# EAGLE design Hi-Hat copy (EAGLE 9.2.2)
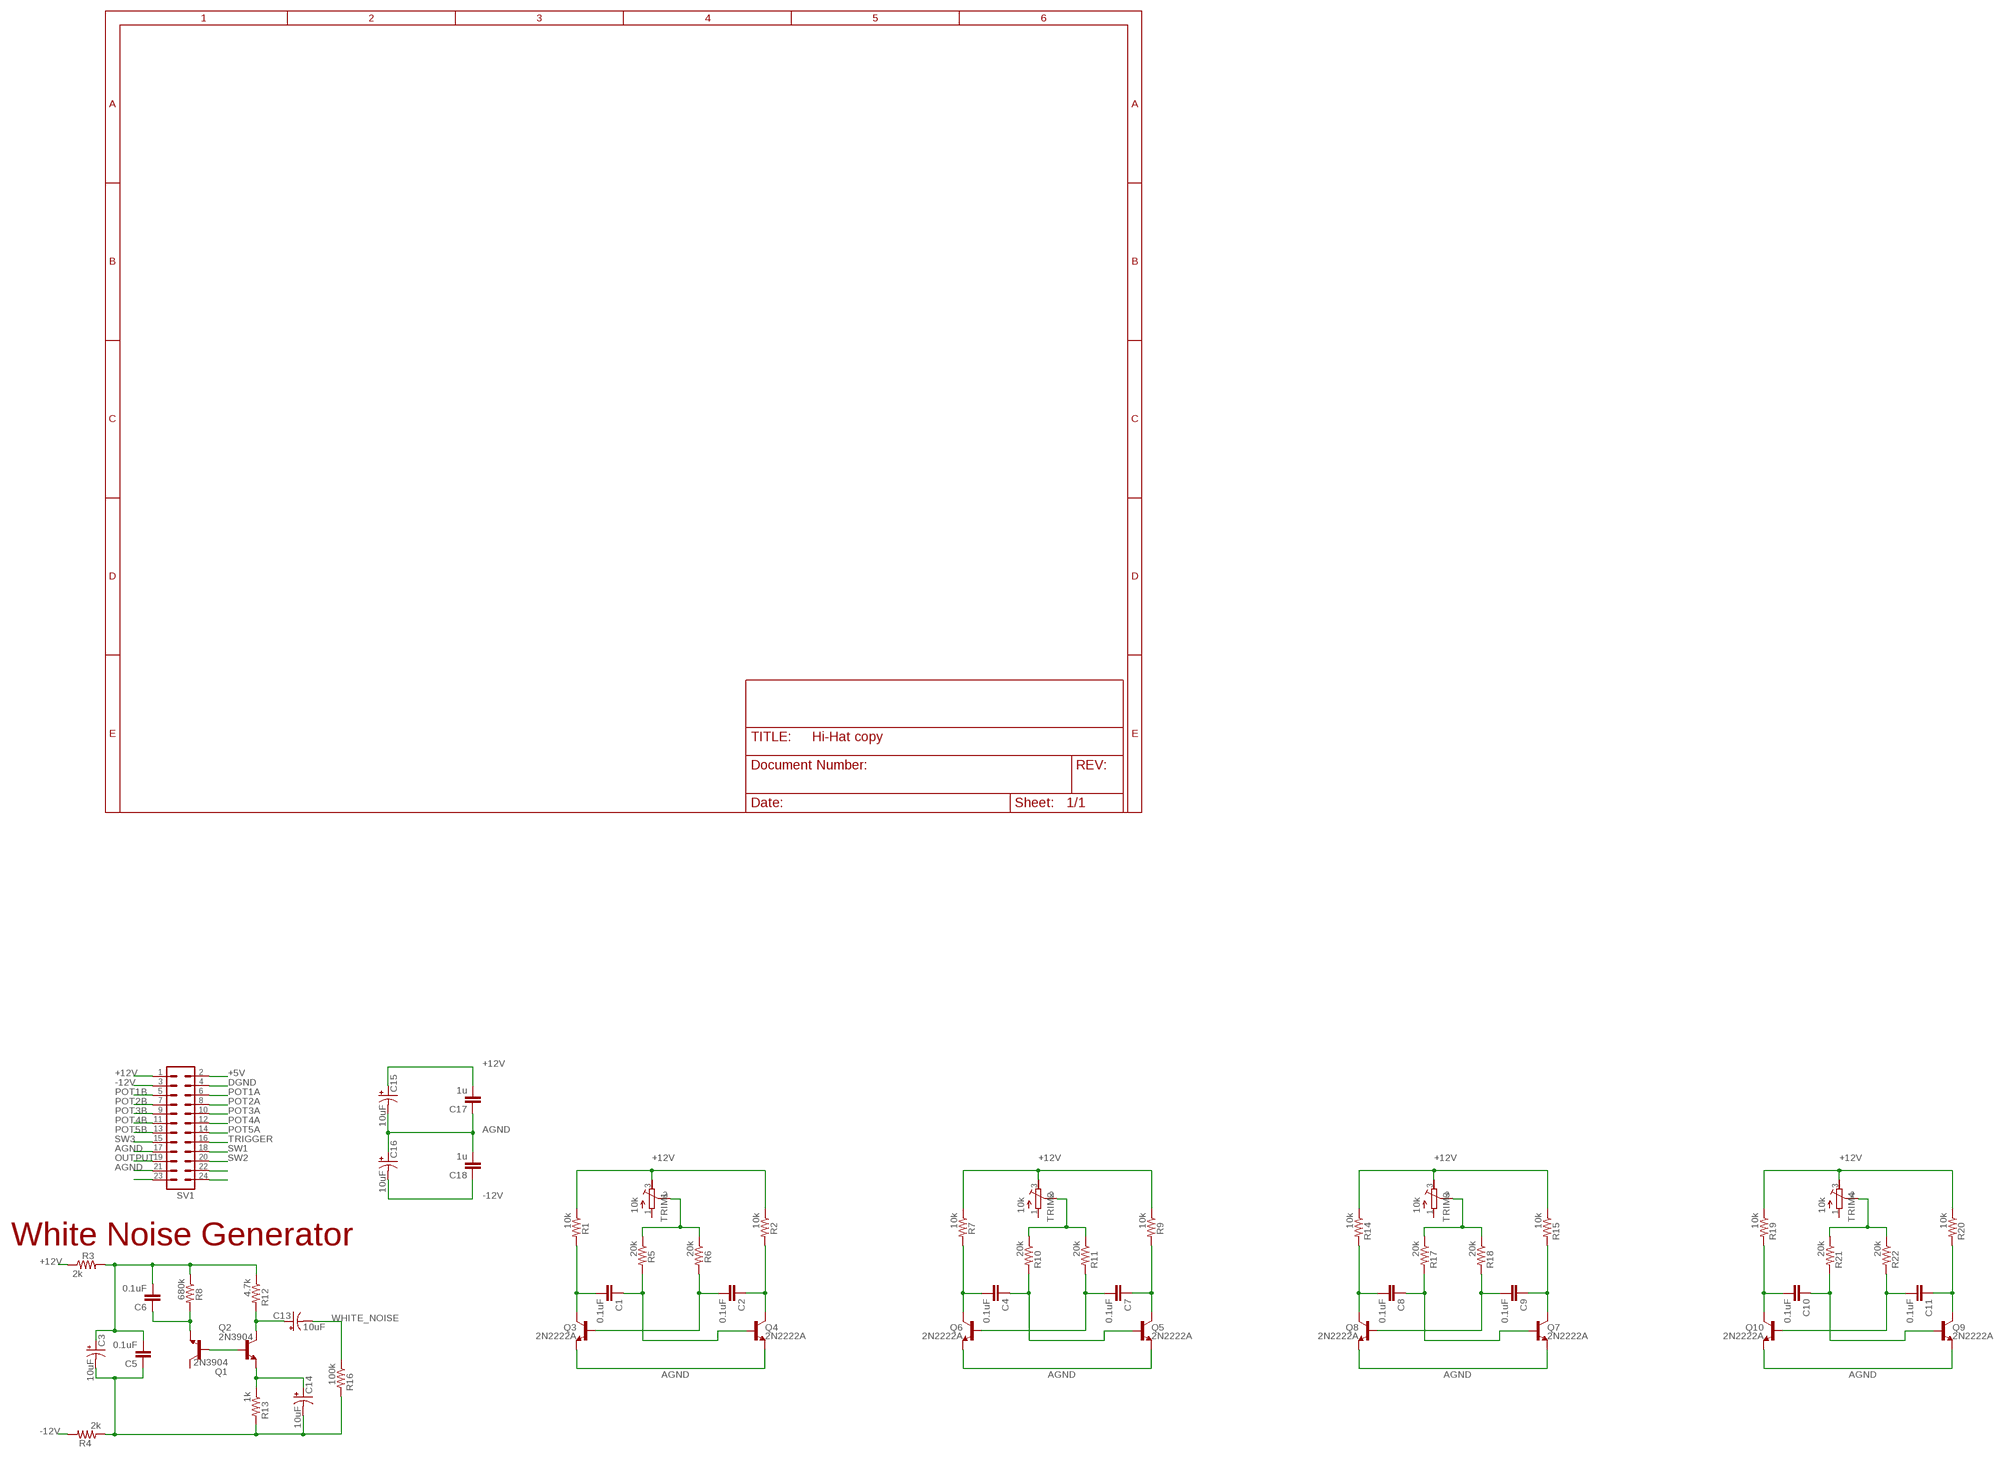
[diagram p0: schematic, sheet 1]

## Parts
C1  0.1uF  C-EU050-024X044  [C050-024X044]
C2  0.1uF  C-EU050-024X044  [C050-024X044]
C3  10uF  CPOL-USE2.5-6  [E2,5-6]
C4  0.1uF  C-EU050-024X044  [C050-024X044]
C5  0.1uF  C-EU050-024X044  [C050-024X044]
C6  0.1uF  C-EU050-024X044  [C050-024X044]
C7  0.1uF  C-EU050-024X044  [C050-024X044]
C8  0.1uF  C-EU050-024X044  [C050-024X044]
C9  0.1uF  C-EU050-024X044  [C050-024X044]
C10  0.1uF  C-EU050-024X044  [C050-024X044]
C11  0.1uF  C-EU050-024X044  [C050-024X044]
C13  10uF  CPOL-USE2.5-6  [E2,5-6]
C14  10uF  CPOL-USE2.5-6  [E2,5-6]
C15  10uF  CPOL-USE2.5-6  [E2,5-6]
C16  10uF  CPOL-USE2.5-6  [E2,5-6]
C17  1u  C-EU050-024X044  [C050-024X044]
C18  1u  C-EU050-024X044  [C050-024X044]
Q1  2N3904  [TO92]
Q2  2N3904  [TO92]
Q3  2N2222A  TRANS_NPN-P2N2222A  [TO-92]
Q4  2N2222A  TRANS_NPN-P2N2222A  [TO-92]
Q5  2N2222A  TRANS_NPN-P2N2222A  [TO-92]
Q6  2N2222A  TRANS_NPN-P2N2222A  [TO-92]
Q7  2N2222A  TRANS_NPN-P2N2222A  [TO-92]
Q8  2N2222A  TRANS_NPN-P2N2222A  [TO-92]
Q9  2N2222A  TRANS_NPN-P2N2222A  [TO-92]
Q10  2N2222A  TRANS_NPN-P2N2222A  [TO-92]
R1  10k  R-US_0207/10  [0207/10]
R2  10k  R-US_0207/10  [0207/10]
R3  2k  R-US_0207/10  [0207/10]
R4  2k  R-US_0207/10  [0207/10]
R5  20k  R-US_0207/10  [0207/10]
R6  20k  R-US_0207/10  [0207/10]
R7  10k  R-US_0207/10  [0207/10]
R8  680k  R-US_0207/10  [0207/10]
R9  10k  R-US_0207/10  [0207/10]
R10  20k  R-US_0207/10  [0207/10]
R11  20k  R-US_0207/10  [0207/10]
R12  4.7k  R-US_0207/10  [0207/10]
R13  1k  R-US_0207/10  [0207/10]
R14  10k  R-US_0207/10  [0207/10]
R15  10k  R-US_0207/10  [0207/10]
R16  100k  R-US_0207/10  [0207/10]
R17  20k  R-US_0207/10  [0207/10]
R18  20k  R-US_0207/10  [0207/10]
R19  10k  R-US_0207/10  [0207/10]
R20  10k  R-US_0207/10  [0207/10]
R21  20k  R-US_0207/10  [0207/10]
R22  20k  R-US_0207/10  [0207/10]
SV1  MA12-2  [MA12-2]
TRIM1  10k  R-TRIMM64W  [RTRIM64W]
TRIM2  10k  R-TRIMM64W  [RTRIM64W]
TRIM3  10k  R-TRIMM64W  [RTRIM64W]
TRIM4  10k  R-TRIMM64W  [RTRIM64W]

## Nets
+5V: SV1.2
+12V: C15.+ C17.2 R1.1 R2.1 R3.1 R7.1 R9.1 R14.1 R15.1 R19.1 R20.1 SV1.1 TRIM1.3(E) TRIM2.3(E) TRIM3.3(E) TRIM4.3(E)
-12V: C16.- C18.1 R4.2 SV1.3
AGND: C15.- C16.+ C17.1 C18.2 Q3.3(E) Q4.3(E) Q5.3(E) Q6.3(E) Q7.3(E) Q8.3(E) Q9.3(E) Q10.3(E) SV1.17 SV1.21
DGND: SV1.4
N$1: C1.2 Q3.1(C) R1.2
N$2: C1.1 Q4.2(B) R5.2
N$3: C2.2 Q3.2(B) R6.2
N$4: C2.1 Q4.1(C) R2.2
N$5: C14.+ Q2.3(E) R13.1
N$6: C3.+ C5.2 C6.2 R3.2 R8.1 R12.1
N$7: C4.2 Q6.1(C) R7.2
N$8: R5.1 R6.1 TRIM1.2(S)
N$9: C4.1 Q5.2(B) R10.2
N$10: C7.2 Q6.2(B) R11.2
N$11: C7.1 Q5.1(C) R9.2
N$12: R10.1 R11.1 TRIM2.2(S)
N$13: C8.2 Q8.1(C) R14.2
N$14: C8.1 Q7.2(B) R17.2
N$15: C9.2 Q8.2(B) R18.2
N$16: C9.1 Q7.1(C) R15.2
N$17: Q1.2(B) Q2.2(B)
N$18: R17.1 R18.1 TRIM3.2(S)
N$19: C10.2 Q10.1(C) R19.2
N$20: C6.1 Q1.3(E) R8.2
N$21: C3.- C5.1 C14.- R4.1 R13.2 R16.2
N$22: C10.1 Q9.2(B) R21.2
N$23: C11.2 Q10.2(B) R22.2
N$24: SV1.23
N$25: SV1.24
N$26: SV1.22
N$27: C11.1 Q9.1(C) R20.2
N$28: R21.1 R22.1 TRIM4.2(S)
N$30: C13.+ Q2.1(C) R12.2
OUTPUT: SV1.19
POT1A: SV1.6
POT1B: SV1.5
POT2A: SV1.8
POT2B: SV1.7
POT3A: SV1.10
POT3B: SV1.9
POT4A: SV1.12
POT4B: SV1.11
POT5A: SV1.14
POT5B: SV1.13
SW1: SV1.18
SW2: SV1.20
SW3: SV1.15
TRIGGER: SV1.16
WHITE_NOISE: C13.- R16.1
Unconnected: Q1.1(C) TRIM1.1(A) TRIM2.1(A) TRIM3.1(A) TRIM4.1(A)

## Notes on the sheet
- White Noise Generator

## Library data of the parts
C1 C2 C4-C11 C17 C18 = resistor:C-EU: CAPACITOR, European symbol
C3 C13-C16 = rcl:CPOL-US: POLARIZED CAPACITOR, American symbol; SPICEPREFIX: C
Q1 Q2 = transistor:2N3904: NPN TRANSISTOR
Q3-Q10 = SparkFun-DiscreteSemi:TRANS_NPN: NPN transistor Current controlled devices typically used to amplify current or used as a switch. BC547 - COM-08928 <http://www.sparkfun.com/products/8928> (TO-92 45V 100mA) (1.Collector 2.Base 3.Emitter) 2N3904 - COM-00521 <http://www.sparkfun.com/products/521> (TO-92 40V 200mA) (1.Emitter 2.Base 3.Collector) P2N2222A - COM-12852 <http://www.sparkfun.com/products/12852> (TO-92 40V 600mA) (1.Collector 2.Base 3.Emitter); PROD_ID: TRANS-09536; VALUE: 600mA/40V
R1-R22 = resistor:R-US_: RESISTOR, American symbol
SV1 = con-lstb:MA12-2: PIN HEADER; OC_FARNELL: unknown; OC_NEWARK: unknown
TRIM1-TRIM4 = rcl:R-TRIMM: Trimm resistor; SPICEMODEL: X; SPICEPREFIXL: POT

## Board
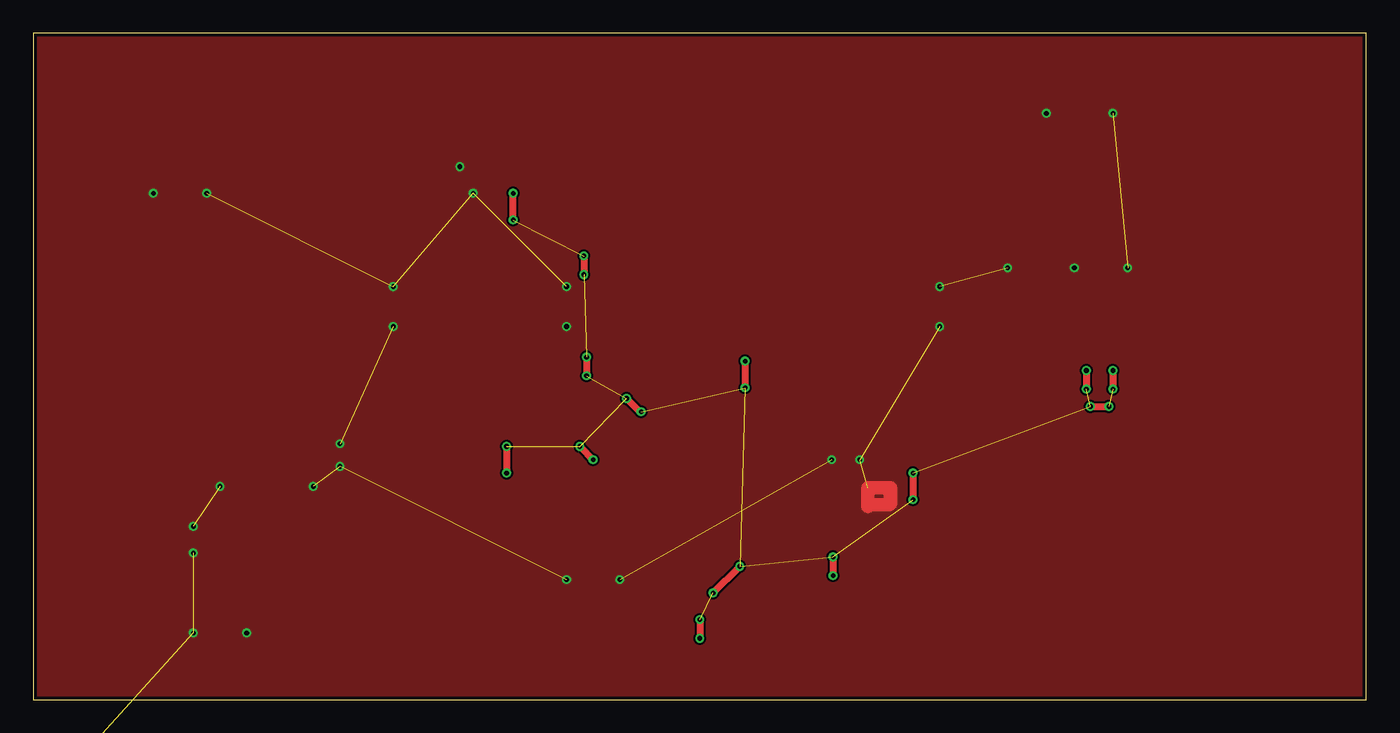
[diagram p1: board, top side]
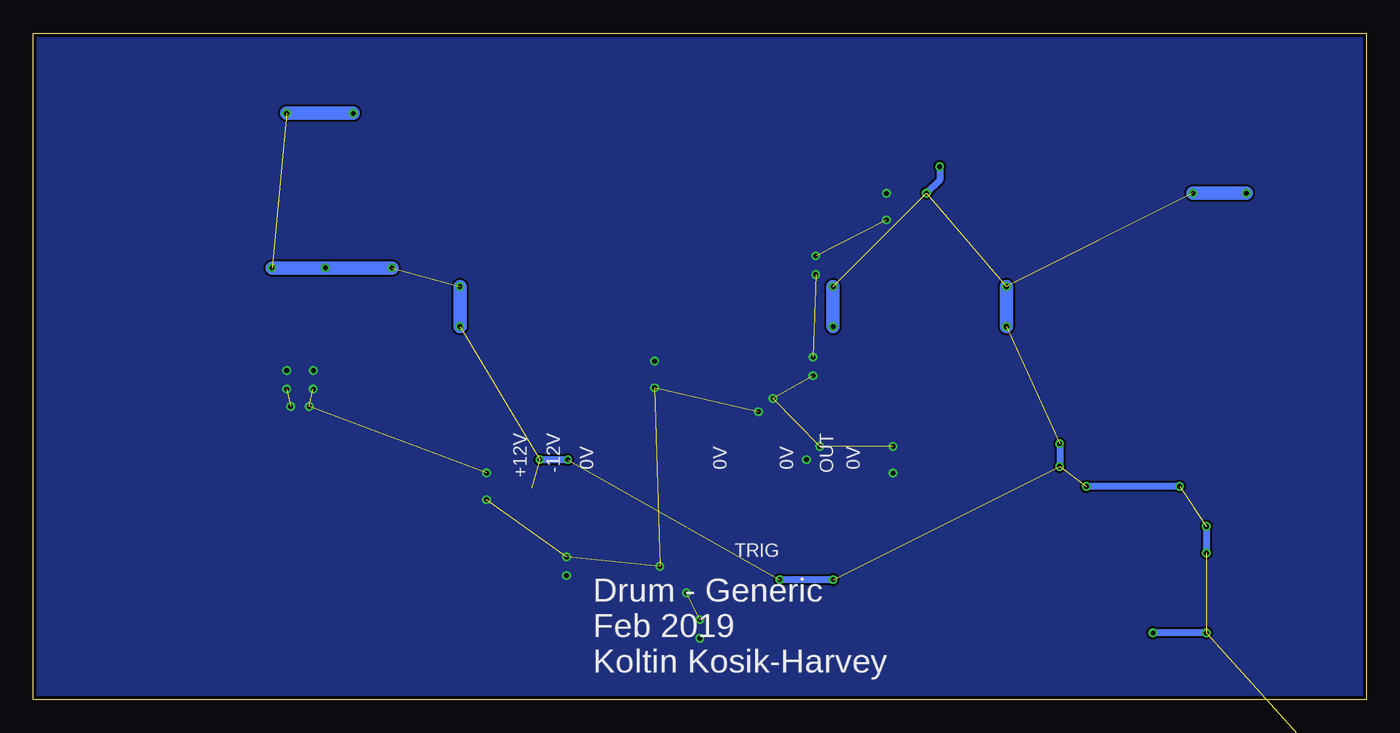
[diagram p2: board, bottom side, seen from below]

Size 100 x 50 mm. Coordinates in mm from the lower left corner, seen from the top.
Outline: 0,0 100,0 100,50 0,50 0,0
Copper layers (1*16): Top 0.035mm / dielectric 1.5mm / Bottom 0.035mm
Design rules "SeeedStudio_2layer_DRU_no_angle_20140221": minimum track width 6mil, minimum drill 12mil, track to track 6mil, track to pad 6mil, pad to pad 6mil, via to via 6mil, smd to smd 0mil, copper to edge 10mil, drill to drill 10mil, minimum pad ring 10mil, minimum via ring 6mil, stop-mask expansion 2mil, vias tented up to drill 100mil, thermal gap 10mil

### Footprints (pad centres in the part's own frame; a part is rotated, then mirrored left to right if it is on the bottom)
C050-024X044 = drill 0.813 octagon: 1 -2.54,0; 2 2.54,0
E2,5-6 = drill 0.813 pad 1.6: + -1.27,0 | drill 0.813 pad 1.6 octagon: - 1.27,0
TO92 = drill 0.813 octagon: 1 1.27,0; 2 0,1.905; 3 -1.27,0
TO-92 = drill 0.813 pad 1.88: 1 -1.27,0; 2 0,1.905; 3 1.27,0
0207/10 = drill 0.813 octagon: 1 -5.08,0; 2 5.08,0
MA12-2 = drill 1.016 octagon: 1 -13.97,-1.27; 2 -13.97,1.27; 3 -11.43,-1.27; 4 -11.43,1.27; 5 -8.89,-1.27; 6 -8.89,1.27; 7 -6.35,-1.27; 8 -6.35,1.27; 9 -3.81,-1.27; 10 -3.81,1.27; 11 -1.27,-1.27; 12 -1.27,1.27; 13 1.27,-1.27; 14 1.27,1.27; 15 3.81,-1.27; 16 3.81,1.27; 17 6.35,-1.27; 18 6.35,1.27; 19 8.89,-1.27; 20 8.89,1.27; 21 11.43,-1.27; 22 11.43,1.27; 23 13.97,-1.27; 24 13.97,1.27
RTRIM64W = drill 0.61: 1 1.27,-2.54; 2 1.27,0; 3 1.27,2.54

### Placement (x,y rotation side)
C1  -4,-90 0 top  (outside the outline)
C2  -4,-97 0 top  (outside the outline)
C3  1,-16 0 top  (outside the outline)
C4  -14,-125 0 top  (outside the outline)
C5  23,-23 0 top  (outside the outline)
C6  30,-23 0 top  (outside the outline)
C7  -7,-125 0 top  (outside the outline)
C8  -14,-163 0 top  (outside the outline)
C9  -7,-163 0 top  (outside the outline)
C10  -14,-201 0 top  (outside the outline)
C11  -7,-201 0 top  (outside the outline)
C13  12,-16 0 top  (outside the outline)
C14  23,-16 0 top  (outside the outline)
C15  1,-23 0 top  (outside the outline)
C16  12,-23 0 top  (outside the outline)
C17  2,-30 0 top  (outside the outline)
C18  9,-30 0 top  (outside the outline)
Q1  25,-41 0 top  (outside the outline)
Q2  1,-46 0 top  (outside the outline)
Q3  -5,-84 0 top  (outside the outline)
Q4  1,-84 0 top  (outside the outline)
Q5  -5,-115 0 top  (outside the outline)
Q6  1,-115 0 top  (outside the outline)
Q7  -5,-153 0 top  (outside the outline)
Q8  1,-153 0 top  (outside the outline)
Q9  -5,-191 0 top  (outside the outline)
Q10  1,-191 0 top  (outside the outline)
R1  4,-62 0 top  (outside the outline)
R2  4,-67 0 top  (outside the outline)
R3  19,-30 0 top  (outside the outline)
R4  4,-37 0 top  (outside the outline)
R5  -11,-104 0 top  (outside the outline)
R6  -11,-109 0 top  (outside the outline)
R7  -11,-132 0 top  (outside the outline)
R8  16,-37 0 top  (outside the outline)
R9  -11,-137 0 top  (outside the outline)
R10  -11,-142 0 top  (outside the outline)
R11  -11,-147 0 top  (outside the outline)
R12  28,-37 0 top  (outside the outline)
R13  4,-42 0 top  (outside the outline)
R14  -11,-170 0 top  (outside the outline)
R15  -11,-175 0 top  (outside the outline)
R16  16,-42 0 top  (outside the outline)
R17  -11,-180 0 top  (outside the outline)
R18  -11,-185 0 top  (outside the outline)
R19  -11,-208 0 top  (outside the outline)
R20  -11,-213 0 top  (outside the outline)
R21  -11,-218 0 top  (outside the outline)
R22  -11,-223 0 top  (outside the outline)
SV1  14,-7 0 top  (outside the outline)
TRIM1  -13,-94 0 top  (outside the outline)
TRIM2  -13,-116 0 top  (outside the outline)
TRIM3  -13,-154 0 top  (outside the outline)
TRIM4  -13,-192 0 top  (outside the outline)

### Tracks (layer width: path | path; a pad name or v marks a point on that pad's centre or on a via)
0V  (via drill 0.35)  (13 unrouted)
  Top 0.508: v50,6 v50,4.6 | v35.5,19 v35.5,17 | v53.4,25.4 v53.4,23.4 | v51,8 v53,10 | v60,10.7 v60,9.3 | v36,36 v36,38 | v66,17 v66,15 | v79.3,22 v80.7,22 | v79,24.7 v79,23.3 | v81,24.7 v81,23.3 | v41,19 v42,18 | v44.5,22.6 45.5,21.6 v45.6,21.6 | v41.5,25.7 v41.5,24.3 | v41.3,33.3 v41.3,31.9
  pour Bottom (no thermals): -2,52 102,52 102,-2 -2,-2
+12V  (via drill 0.35)  (29 unrouted)
  Top 1.016: 62.6,14.5 62.6,15.9 64.3,15.9 64.3,14.7 64.2,14.6 63,14.6
  Bottom 0.508: v40,9 v44,9 | v12,5 v16,5 | v59.9,18 v62,18 | v32,40 32,39 v33,38 | v12,13 v12,11 | v14,16 v21,16 | v23,19.2 v23,17.5
  Bottom 1.016: v40,31 v40,28 | v27,31 v27,28 | v68,31 v68,28 | v73.1,32.4 v78.1,32.4 v82.1,32.4 | v76,44 v81,44 | v9,38 v13,38
  pour Top (no thermals): -1,51 -1,-1 101,-1 101,51
-12V  (3 unrouted)
AGND  (13 unrouted)
N$1  (2 unrouted)
N$2  (2 unrouted)
N$3  (2 unrouted)
N$4  (2 unrouted)
N$5  (2 unrouted)
N$6  (5 unrouted)
N$7  (2 unrouted)
N$8  (2 unrouted)
N$9  (2 unrouted)
N$10  (2 unrouted)
N$11  (2 unrouted)
N$12  (2 unrouted)
N$13  (2 unrouted)
N$14  (2 unrouted)
N$15  (2 unrouted)
N$16  (2 unrouted)
N$17  (1 unrouted)
N$18  (2 unrouted)
N$19  (2 unrouted)
N$20  (2 unrouted)
N$21  (5 unrouted)
N$22  (2 unrouted)
N$23  (2 unrouted)
N$27  (2 unrouted)
N$28  (2 unrouted)
N$30  (2 unrouted)
WHITE_NOISE  (1 unrouted)

### Text on the board
bNames: OUT | -12V | +12V | 0V | 0V | 0V | 0V | TRIG | Drum - Generic / Feb 2019 / Koltin Kosik-Harvey